# Altium schematic sheet EDISON.SchDoc
size A
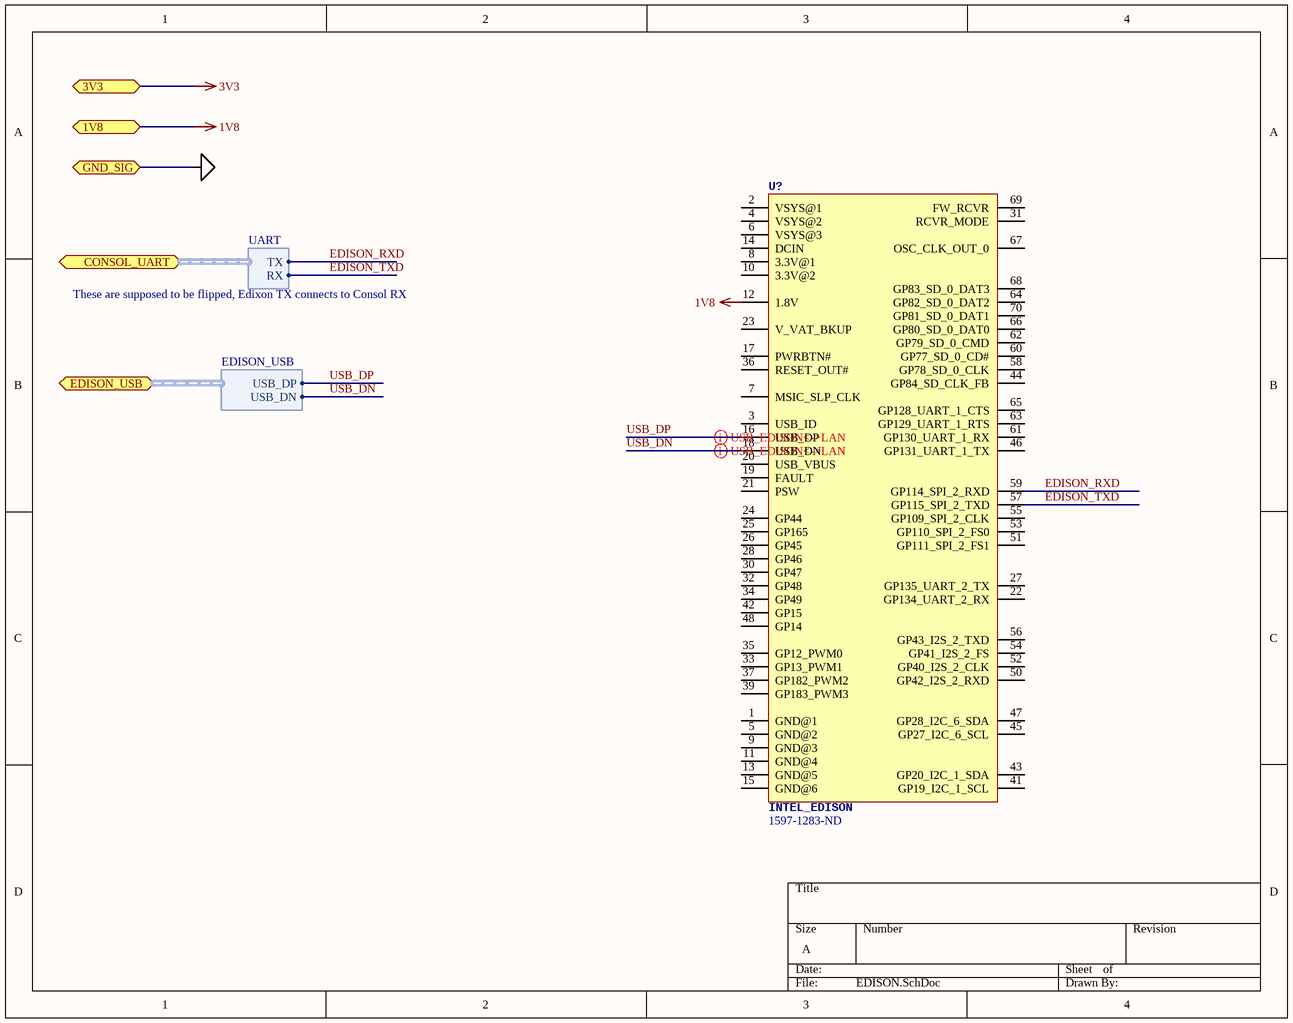
[diagram p0: EDISON.SchDoc]

## Parts
U?  INTEL_EDISON  Supplier Part Number 1: 1597-1283-ND  [INTEL_EDISON]

## Ports
1V8, 3V3, CONSOL_UART (harness UART), EDISON_USB (harness EDISON_USB), GND_SIG

## Harnesses
UART: RX, TX
EDISON_USB: USB_DN, USB_DP

## Nets
1V8: U?.12(1.8V) ; port 1V8
3V3: port 3V3
GDNSIG: port GND_SIG
EDISON_RXD: U?.59(GP114_SPI_2_RXD) ; port CONSOL_UART.TX
EDISON_TXD: U?.57(GP115_SPI_2_TXD) ; port CONSOL_UART.RX
USB_DN: U?.18(USB_DN) ; port EDISON_USB.USB_DN
USB_DP: U?.16(USB_DP) ; port EDISON_USB.USB_DP

Not connected (* = marked no-connect by the designer): U? 1(GND@1) 2(VSYS@1) 3(USB_ID) 4(VSYS@2) 5(GND@2) 6(VSYS@3) 7(MSIC_SLP_CLK) 8(3.3V@1) 9(GND@3) 10(3.3V@2) 11(GND@4) 13(GND@5) 14(DCIN) 15(GND@6) 17(PWRBTN#) 19(FAULT) 20(USB_VBUS) 21(PSW) 22(GP134_UART_2_RX) 23(V_VAT_BKUP) 24(GP44) 25(GP165) 26(GP45) 27(GP135_UART_2_TX) 28(GP46) 30(GP47) 31(RCVR_MODE) 32(GP48) 33(GP13_PWM1) 34(GP49) 35(GP12_PWM0) 36(RESET_OUT#) 37(GP182_PWM2) 39(GP183_PWM3) 41(GP19_I2C_1_SCL) 42(GP15) 43(GP20_I2C_1_SDA) 44(GP84_SD_CLK_FB) 45(GP27_I2C_6_SCL) 46(GP131_UART_1_TX) 47(GP28_I2C_6_SDA) 48(GP14) 50(GP42_I2S_2_RXD) 51(GP111_SPI_2_FS1) 52(GP40_I2S_2_CLK) 53(GP110_SPI_2_FS0) 54(GP41_I2S_2_FS) 55(GP109_SPI_2_CLK) 56(GP43_I2S_2_TXD) 58(GP78_SD_0_CLK) 60(GP77_SD_0_CD#) 61(GP130_UART_1_RX) 62(GP79_SD_0_CMD) 63(GP129_UART_1_RTS) 64(GP82_SD_0_DAT2) 65(GP128_UART_1_CTS) 66(GP80_SD_0_DAT0) 67(OSC_CLK_OUT_0) 68(GP83_SD_0_DAT3) 69(FW_RCVR) 70(GP81_SD_0_DAT1)

## Layout directives
differential pair: USB_DN, USB_DP

## Notes on the sheet
- These are supposed to be flipped, Edixon TX connects to Consol RX

## Library data of the parts
U? = INTEL_EDISON: Edison Intel® Edison Platform Atom™ Series MPU Atom™ Core Embedded Evaluation Board; Manufacturer: Seeed Technology Co., Ltd; Manufacturer Part Number: 102990283; Board Type: Evaluation Platform; Contents: Board(s); Supplier 1: Digi-Key; RoHS: RoHS Compliant; Category: Programmers, Development Systems; Stock 1: 17; Pricing 1: 1=59.94 (USD); Type: MPU; Core Processor: Atom™; Operating System: -; Platform: Intel® Edison; For Use With/Related Products: Edison; Mounting Type: Fixed; ComponentLink1URL: http://www.intel.com/content/dam/support/us/en/documents/edison/sb/edison_pb_331179002.pdf; ComponentLink1Description: http://www.intel.com/content/dam/support/us/en/documents/edison/sb/edison_pb_331179002.pdf